# EAGLE design Grove - Capacitive Moisture Sensor (Corrosion Resistant) (EAGLE 9.6.2)
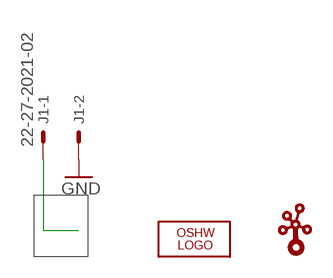
[diagram p0: schematic, sheet 1]

## Parts
J1  22-27-2021-02  [6410-02]
LOGO1  LOGO-OSHW-FILLX0200-NT  [OSHW_FILLX200_NOTEXT]
U$7  LOGO-GROVE  [GROVE-SILK-BIG]

## Nets
GND: J1.2
N$5: J1.1

## Library data of the parts
J1 = con-molex:22-?-02: CONNECTOR wire to board 2.54 mm (.1 inch) pitch header; MF: MOLEX; OC_FARNELL: unknown; OC_NEWARK: unknown
LOGO1 = logo:LOGO-OSHW-FILL; PARTNO: DNP
U$7 = logo:LOGO-GROVE; PARTNO: DNP

## Board
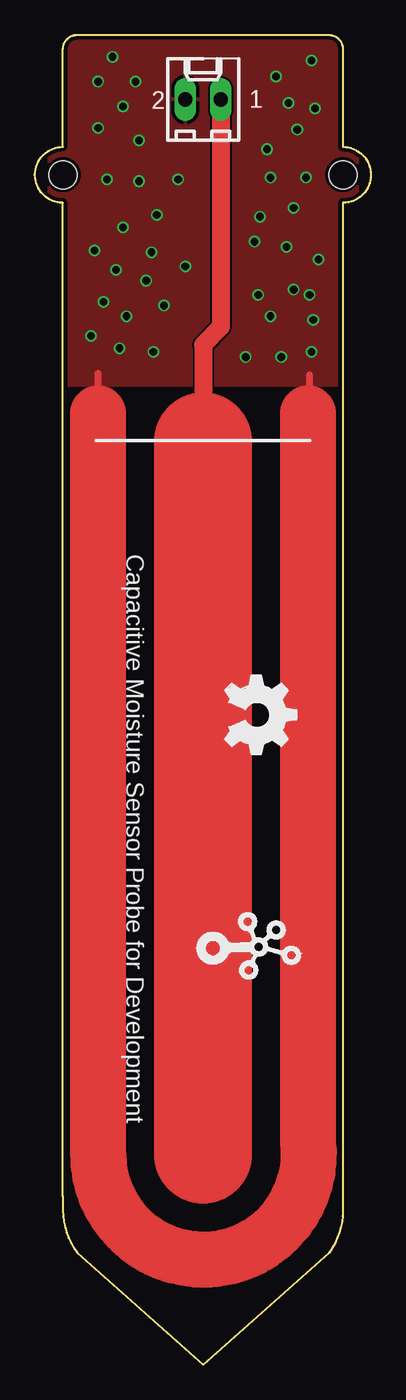
[diagram p1: board, top side]
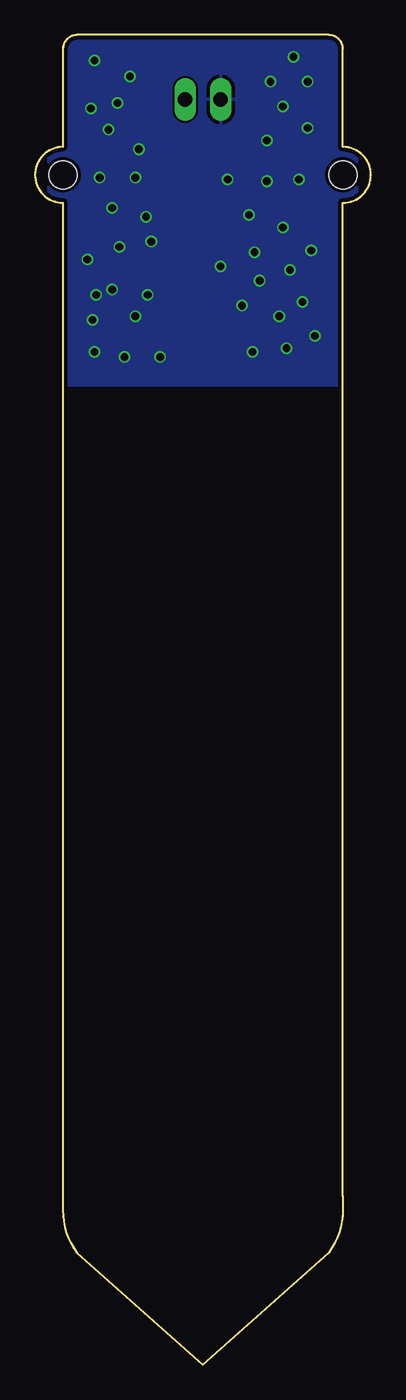
[diagram p2: board, bottom side, seen from below]

Size 24 x 95.03 mm. Coordinates in mm from the lower left corner, seen from the top.
Outline: 22,12.03 22,83.03 arc180 22,87.03 22,94.03 arc90 21,95.03 3,95.03 arc90 2,94.03 2,87.03 arc180 2,83.03 2,12.03
Outline: 2,12.03 2,11.03 arc37 3.01,8 12.01,0 21.01,8 arc37 22,11.03 22,12.03
Copper layers (1*16): Top 0.035mm / dielectric 1.5mm / Bottom 0.035mm
Design rules "SeeedStudio_2layer_DRU_no_angle_20140221": minimum track width 1mil, minimum drill 10mil, track to track 6mil, track to pad 6mil, pad to pad 6mil, via to via 6mil, smd to smd 0mil, copper to edge 10mil, drill to drill 10mil, minimum pad ring 4mil, minimum via ring 4mil, stop-mask expansion 2mil, vias tented up to drill 25mil, thermal gap 10mil
Holes 2 mm at 2,85.03 22,85.03

### Footprints (pad centres in the part's own frame; a part is rotated, then mirrored left to right if it is on the bottom)
6410-02 = drill 1.016 long: 1 1.27,0; 2 -1.27,0

### Placement (x,y rotation side)
J1  12.01,90.42 0 top
LOGO1  13.58,49.28 270 top
U$7  12.52,29.82 270 top

### Tracks (layer width: path | path; a pad name or v marks a point on that pad's centre or on a via)
GND  (via drill 0.55)
  Top 0.254: 4.25,68 4.51,68 4.51,69.19 | 20.76,68 19.51,68 19.63,68.12 19.63,69.04 | 4.51,70.86 4.52,70.87
  Top 0.508: 4.51,69.19 4.51,70.86 | 19.63,69.04 19.63,70.74
  Top 4: 19.51,68 19.51,15.97 arc-187 4.51,15.03 4.51,68
  other vias: 4.52,91.69 7.18,91.69 7.44,87.5 4.52,88.39 5.15,84.71 7.44,84.58 8.71,82.17 6.29,81.28 4.26,79.63 5.79,78.23 7.94,77.47 9.21,75.69 6.55,74.93 4.9,75.95 4.01,73.53 6.04,72.64 8.45,72.39 15.06,72.01 17.6,72.01 19.76,72.39 19.88,74.68 16.83,74.93 15.95,76.45 18.49,76.83 19.63,76.45 20.26,78.99 17.98,79.88 15.69,80.26 16.07,82.04 18.49,82.68 19.37,84.84 16.83,84.84 16.58,86.87 18.74,88.27 20.01,89.79 18.1,90.17 17.22,92.08 19.76,93.22 6.29,89.92 5.53,93.47 8.33,79.5 10.74,78.49 10.23,84.71
  pour Top: 1.01,96 23.01,96 23.01,70 1.01,70
  pour Bottom: 1.01,96 23.01,96 23.01,70 1.01,70
N$5
  Top 0.254: 12.01,66 12.01,67.96
  Top 0.635: 12,67.96 12.01,67.96
  Top 1.27: J1.1 13.28,74.17 12.01,72.9 12.01,66
  Top 7: 12.01,15 12.01,66

### Text on the board
tNames: Capacitive Moisture Sensor Probe for Development